# EAGLE schematic pong (EAGLE 9.4.2)
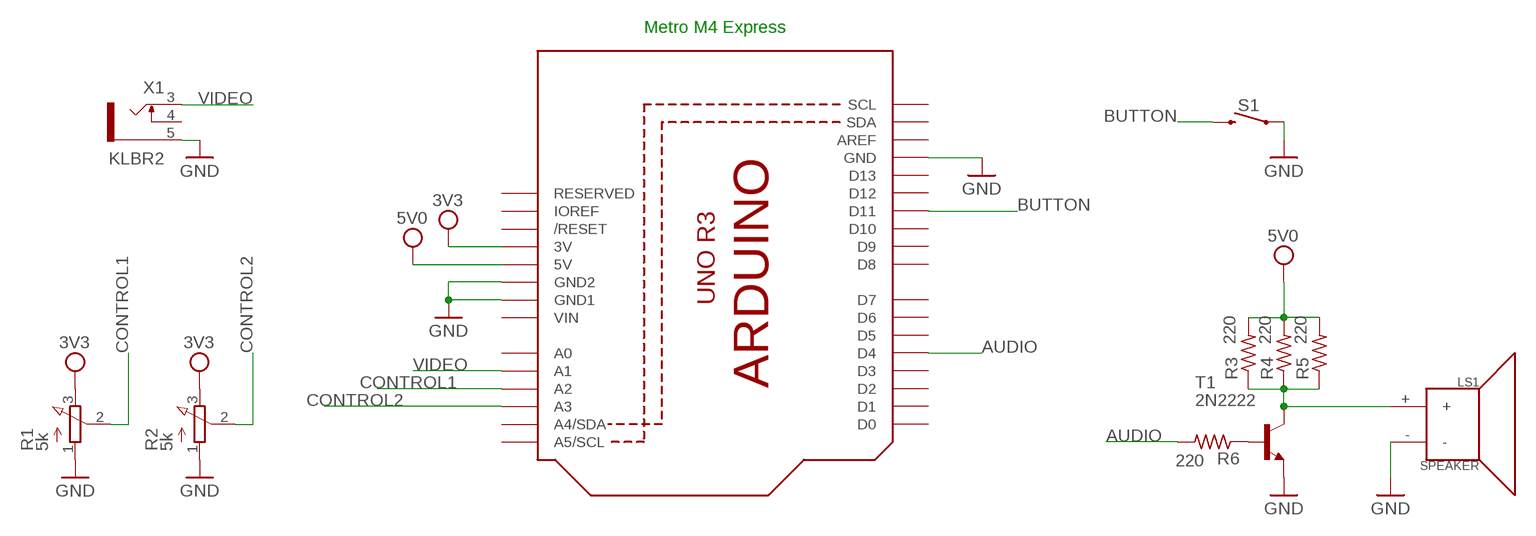
[diagram p0: schematic, sheet 1]

## Parts
LS1  SPEAKER  [PCB_MOUNT_SPEAKER]
R1  5k  3RP/1610N  [3RP/1610N]
R2  5k  3RP/1610N  [3RP/1610N]
R3  220  R-US_0309/12  [0309/12]
R4  220  R-US_0309/12  [0309/12]
R5  220  R-US_0309/12  [0309/12]
R6  220  R-US_0309/12  [0309/12]
S1  Start Button  MOMENTARY-SWITCH-SPST-PTH-6.0MM-KIT  [TACTILE_SWITCH_PTH_6.0MM_KIT]
T1  2N2222  [TO92-EBC-OVAL]
U1  ARDUINOR3-DIMENSION  [ARDUINOR3]
X1  KLBR2  [KLBR2]

## Nets
3V3: R1.3(E) R2.3(E) U1.3V
5V0: R3.2 R4.2 R5.2 U1.5V
AUDIO: R6.2 U1.D4
BUTTON: S1.3 U1.D11
CONTROL1: R1.2(S) U1.A2
CONTROL2: R2.2(S) U1.A3
GND: LS1.- R1.1(A) R2.1(A) S1.1 T1.E U1.GND U1.GND1 U1.GND2 X1.5
N$1: LS1.+ R3.1 R4.1 R5.1 T1.C
N$2: R6.1 T1.B
VIDEO: U1.A1 X1.3
Unconnected: U1.A0 U1.A4(A4/SDA) U1.A5(A5/SCL) U1.AREF U1.D0 U1.D1 U1.D2 U1.D3 U1.D5 U1.D6 U1.D7 U1.D8 U1.D9 U1.D10 U1.D12 U1.D13 U1.IOREF U1.RESERVED U1.RESET(/RESET) U1.SCL U1.SDA X1.4

## Notes on the sheet
- Metro M4 Express

## Power pins joined to a net without a drawn wire
VIN: U1.VIN

## Library data of the parts
LS1 = SparkFun-Electromechanical:SPEAKER: Speaker Generic 2-terminal loudspeakers SparkFun Products Speaker - PCB Mount <https://www.sparkfun.com/products/11089> (COM-11089); PROD_ID: COMP-11789; SF_SKU: COM-11089; SPICEPREFIX: L
R1 R2 = pot:3RP/1610N: 16mm Potentiometer one level Source: http://www.alphapotentiometers.net/html/16mm_pot_2.html
R3-R6 = resistor:R-US_: RESISTOR, American symbol; SPICEPREFIX: R
S1 = SparkFun-Switches:MOMENTARY-SWITCH-SPST: Momentary Switch (Pushbutton) - SPST Normally-open (NO) SPST momentary switches (buttons, pushbuttons). Variants PTH-12MM - 12mm square, through-hole Momentary Pushbutton Switch - 12mm Square <https://www.sparkfun.com/products/9190> (COM-09190) PTH-6.0MM, PTH-6.0MM-KIT - 6.0mm square, through-hole Mini Pushbutton Switch <https://www.sparkfun.com/products/97> (COM-00097) KIT package intended for soldering kit's - only one side of pads' copper is exposed. PTH-RIGHT-ANGLE-KIT - Right-angle, through-hole Right Angle Tactile Button <https://www.sparkfun.com/products/10791> - Used on SparkFun BigTime Watch Kit <https://www.sparkfun.com/products/11734> SMD-12MM - 12mm square, surface-mount Tactile Button - SMD (12mm) <https://www.sparkfun.com/products/12993> (COM-12993) Used on SparkFun PicoBoard <https://www.sparkfun.com/products/11888> SMD-4.5MM - 4.5mm Square Trackball Switch Used on SparkFun Blackberry Trackballer Breakout <https://www.sparkfun.com/products/13169> SMD-4.6MMX2.8MM - 4.60mm x 2.80mm, surface mount Used on SparkFun SAMD21 Mini Breakout <https://www.sparkfun.com/products/13664> SMD-5.2MM, SMD-5.2-REDUNDANT - 5.2mm square, surface-mount Mini Pushbutton Switch - SMD <https://www.sparkfun.com/products/8720> (COM-08720) Used on Arduino Pro Mini <https://www.sparkfun.com/products/11114> REDUNDANT package connects both switch circuits together SMD-6.0X3.5MM - 6.0 x 3.5mm, surface mount Momentary Reset Switch SMD <https://www.sparkfun.com/products/8229> (COM-08229) SMD-6.2MM-TALL - 6.2mm square, surface mount Tactile Button - SMD (6mm) <https://www.sparkfun.com/products/12992> Used on SparkFun Digital Sandbox <https://www.sparkfun.com/products/12651> SMD-RIGHT-ANGLE - Right-angle, surface mount Used on SparkFun Block for Intel® Edison - Arduino <https://www.sparkfun.com/products/13036>; PROD_ID: SWCH-08441; SF_SKU: COM-00097
T1 = adafruit:2N2222: NPN TRANSISTOR Big oval pads; SPICEPREFIX: J
U1 = adafruit:ARDUINOR3: This is a new object for the new Arduino R3 - with extra pins that you may want to use (such as IOref, and duplicated A4/A5
X1 = con-lumberg:KLBR?: Jack connectors according to JISC 6560, 2.5mm / 3.5 mm Klinkensteckverbinder nach JISC 6560, 2.5mm / 3,5 mm Source: http://www.lumberg.com/Produkte/PDFs/KLBR2.pdf www.lumberg.com/Produkte/PDFs/KLBR1.pdf; OC_FARNELL: unknown; OC_NEWARK: unknown